# Altium schematic sheet SSOP-TSSOP8.SchDoc
size B
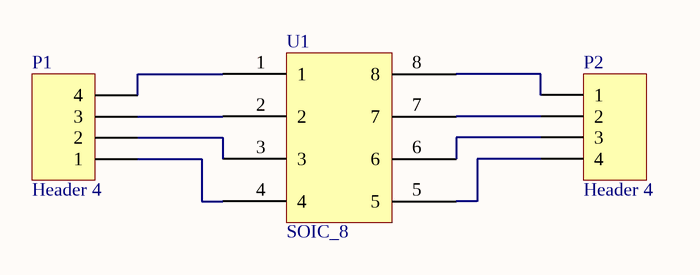
[diagram p0: SSOP-TSSOP8.SchDoc]

## Parts
P1  Header 4  [HDR1X4]
P2  Header 4  [HDR1X4]
U1  SOIC_8  [SOIC8]

## Nets
NetP1_1: P1.1 U1.4
NetP1_2: P1.2 U1.3
NetP1_3: P1.3 U1.2
NetP1_4: P1.4 U1.1
NetP2_1: P2.1 U1.8
NetP2_2: P2.2 U1.7
NetP2_3: P2.3 U1.6
NetP2_4: P2.4 U1.5

## Library data of the parts
P1 P2 = Header 4: Header, 4-Pin; LatestRevisionDate: 17-Jul-2002; LatestRevisionNote: Re-released for DXP Platform.; Publisher: Altium Limited